# Altium schematic sheet remout_pwr.SchDoc
size A4; SheetNumber: 4; SheetTotal: 14
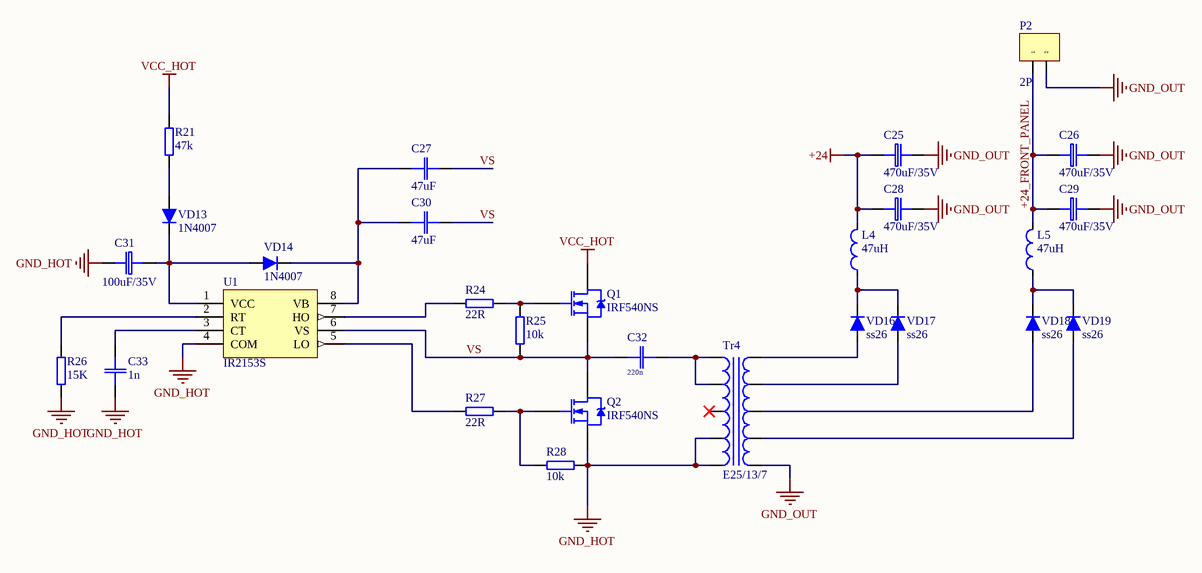
[diagram p0: remout_pwr.SchDoc]

## Parts
C25  470uF/35V  [CAP: D6.3C2.5H11]
C26  470uF/35V  [CAP: D6.3C2.5H11]
C27  47uF  [CAP: 1210]
C28  470uF/35V  [CAP: D6.3C2.5H11]
C29  470uF/35V  [CAP: D6.3C2.5H11]
C30  47uF  [CAP: 1210]
C31  100uF/35V  [CAP: D6.3C2.5H11]
C32  220n  [MKP 13x5 h11 R10]
C33  1n  [CAP: 0805]
L4  47uH  [IND: SRP1265A]
L5  47uH  [IND: SRP1265A]
P2  2P  [CON: 2P V 3.5mm]
Q1  IRF540NS  [D2PAK_N]
Q2  IRF540NS  [D2PAK_N]
R21  47k  [RES: 2W H]
R24  22R  [RES: 0805]
R25  10k  [RES: 0805]
R26  15K  [RES: 0805]
R27  22R  [RES: 0805]
R28  10k  [RES: 0805]
Tr4  E25/13/7  [TRANS: E25/13/7]
U1  IR2153S  [SO-8_N]
VD13  1N4007  [DIODE: SMA]
VD14  1N4007  [DIODE: SMA]
VD16  ss26  [DIODE: SMA]
VD17  ss26  [DIODE: SMA]
VD18  ss26  [DIODE: SMA]
VD19  ss26  [DIODE: SMA]

## Nets
+24: C25.1(+) C28.1(+) L4.2
GND_HOT: C31.2(-) C33.1 Q2.3(S) R26.2 R28.1 Tr4.4 Tr4.5 U1.4(COM)
GND_OUT: C25.2(-) C26.2(-) C28.2(-) C29.2(-) P2.2 Tr4.6
VCC_HOT: Q1.2(D) R21.1
+24_FRONT_PANEL: C26.1(+) C29.1(+) L5.2 P2.1
VS: C27.1 C30.1 C32.1 Q1.3(S) Q2.2(D) R25.1 U1.6(VS)
NetC27_2: C27.2 C30.2 U1.8(VB) VD14.2(C)
NetC31_1: C31.1(+) U1.1(VCC) VD13.2(C) VD14.1(A)
NetC32_2: C32.2 Tr4.1 Tr4.2
NetC33_2: C33.2 U1.3(CT)
NetL4_1: L4.1 VD16.2(C) VD17.2(C)
NetL5_1: L5.1 VD18.2(C) VD19.2(C)
NetQ1_1: Q1.1(G) R24.2 R25.2
NetQ2_1: Q2.1(G) R27.2 R28.2
NetR21_2: R21.2 VD13.1(A)
NetR24_1: R24.1 U1.7(HO)
NetR26_1: R26.1 U1.2(RT)
NetR27_1: R27.1 U1.5(LO)
NetTr4_7: Tr4.7 VD19.1(A)
NetTr4_8: Tr4.8 VD18.1(A)
NetTr4_9: Tr4.9 VD17.1(A)
NetTr4_10: Tr4.10 VD16.1(A)

Not connected (* = marked no-connect by the designer): Tr4 3*

## Library data of the parts
C25 C26 C28 C29 C31 = C_EL
  C25 C26 C28 C29: Value: 470uF/35V
  C31: Value: 100uF/35V
C27 C30 C33 = C_SMD
  C27 C30: Value: 47uF
  C33: Value: 1n
C32 = MKS4 68n 400V: Value: 220n
L4 L5 = L_SMD: Value: 47uH
Q1 Q2 = IRF540NS: HEXFET Power MOSFET; Published: 8-Jun-2000; LatestRevisionDate: 20-Nov-2009; LatestRevisionNote: IPC-7351 Footprint Added.; DatasheetVersion: May-1998; PackageReference: D2PAK; Publisher: Altium Limited; PackageDescription: 3-Pin Transistor Outline Package 2.54 mm Pitch, 15.1 mm Lead Span; ComponentLink1Description: Manufacturer Link; ComponentLink1URL: http://www.irf.com/; ComponentLink2Description: Datasheet; ComponentLink2URL: http://www.irf.com/product-info/datasheets/data/irf540ns.pdf
R21 = R_DIP: Value: 47k
R24-R28 = R_SMD
  R24 R27: Value: 22R
  R25 R28: Value: 10k
  R26: Value: 15K
U1 = IR2153S: Self-Oscillating Half-Bridge Driver; Published: 8-Jun-2000; LatestRevisionDate: 13-Apr-2006; LatestRevisionNote: IPC-7351 Footprint Added.; DatasheetVersion: PD60062J; PackageVersion: Feb-2001; PackageReference: SO-8; Publisher: Altium Limited; PackageDescription: 8-Pin Plastic Small Outline Integrated Circuit 1.27 mm Pitch; Code_JEDEC: MS-012-AA; Code_IPC: SOIC127P600-8; ComponentLink1Description: Manufacturer Link; ComponentLink1URL: http://www.irf.com/; ComponentLink2Description: Datasheet; ComponentLink2URL: http://www.irf.com/product-info/datasheets/data/ir2153.pdf
VD13 VD14 VD16-VD19 = DIODE_SMD
  VD13 VD14: Value: 1N4007
  VD16-VD19: Value: ss26
P2 = 2P: Value: 2P
Tr4 = E25/13/7: Value: E25/13/7